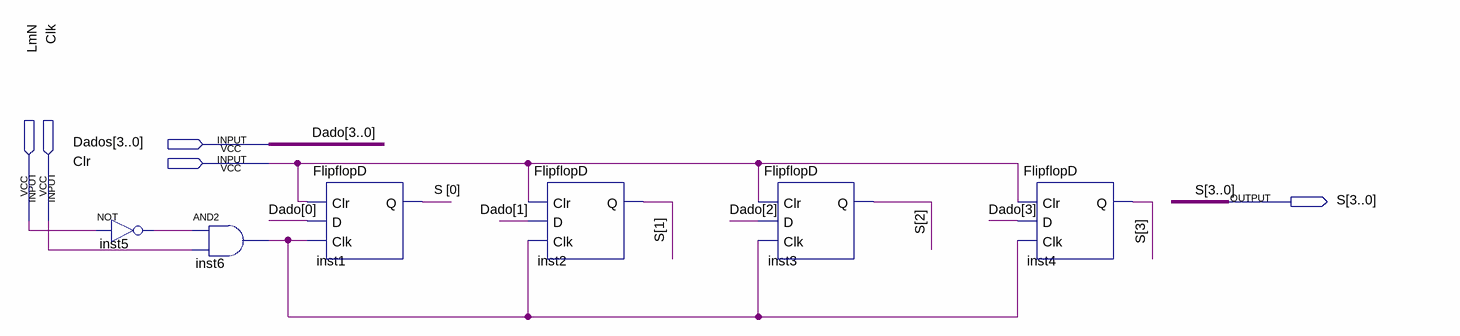
[diagram p0: schematic sheet]
// Quartus schematic MemoriaRem.bdf as structural Verilog: 6 symbols, 5 pins
module MemoriaRem (
  input  [3:0] Dados,
  input  Clr,
  input  LmN,
  input  Clk,
  output [3:0] S
);

  wire inst5_out, inst6_out;

  not inst5 (inst5_out, LmN);
  and inst6 (inst6_out, inst5_out, Clk);
  FlipflopD inst1 (.Clr(Clr), .D(Dados[0]), .Clk(inst6_out), .Q(S[0]));
  FlipflopD inst2 (.Clr(Clr), .D(Dados[1]), .Clk(inst6_out), .Q(S[1]));
  FlipflopD inst3 (.Clr(Clr), .D(Dados[2]), .Clk(inst6_out), .Q(S[2]));
  FlipflopD inst4 (.Clr(Clr), .D(Dados[3]), .Clk(inst6_out), .Q(S[3]));

  // Other names for the same wires on the sheet: Dado[3:0] = Dados
endmodule
